# Altium schematic sheet Conventions.SchDoc
size A4; SheetNumber: 1; SheetTotal: 3
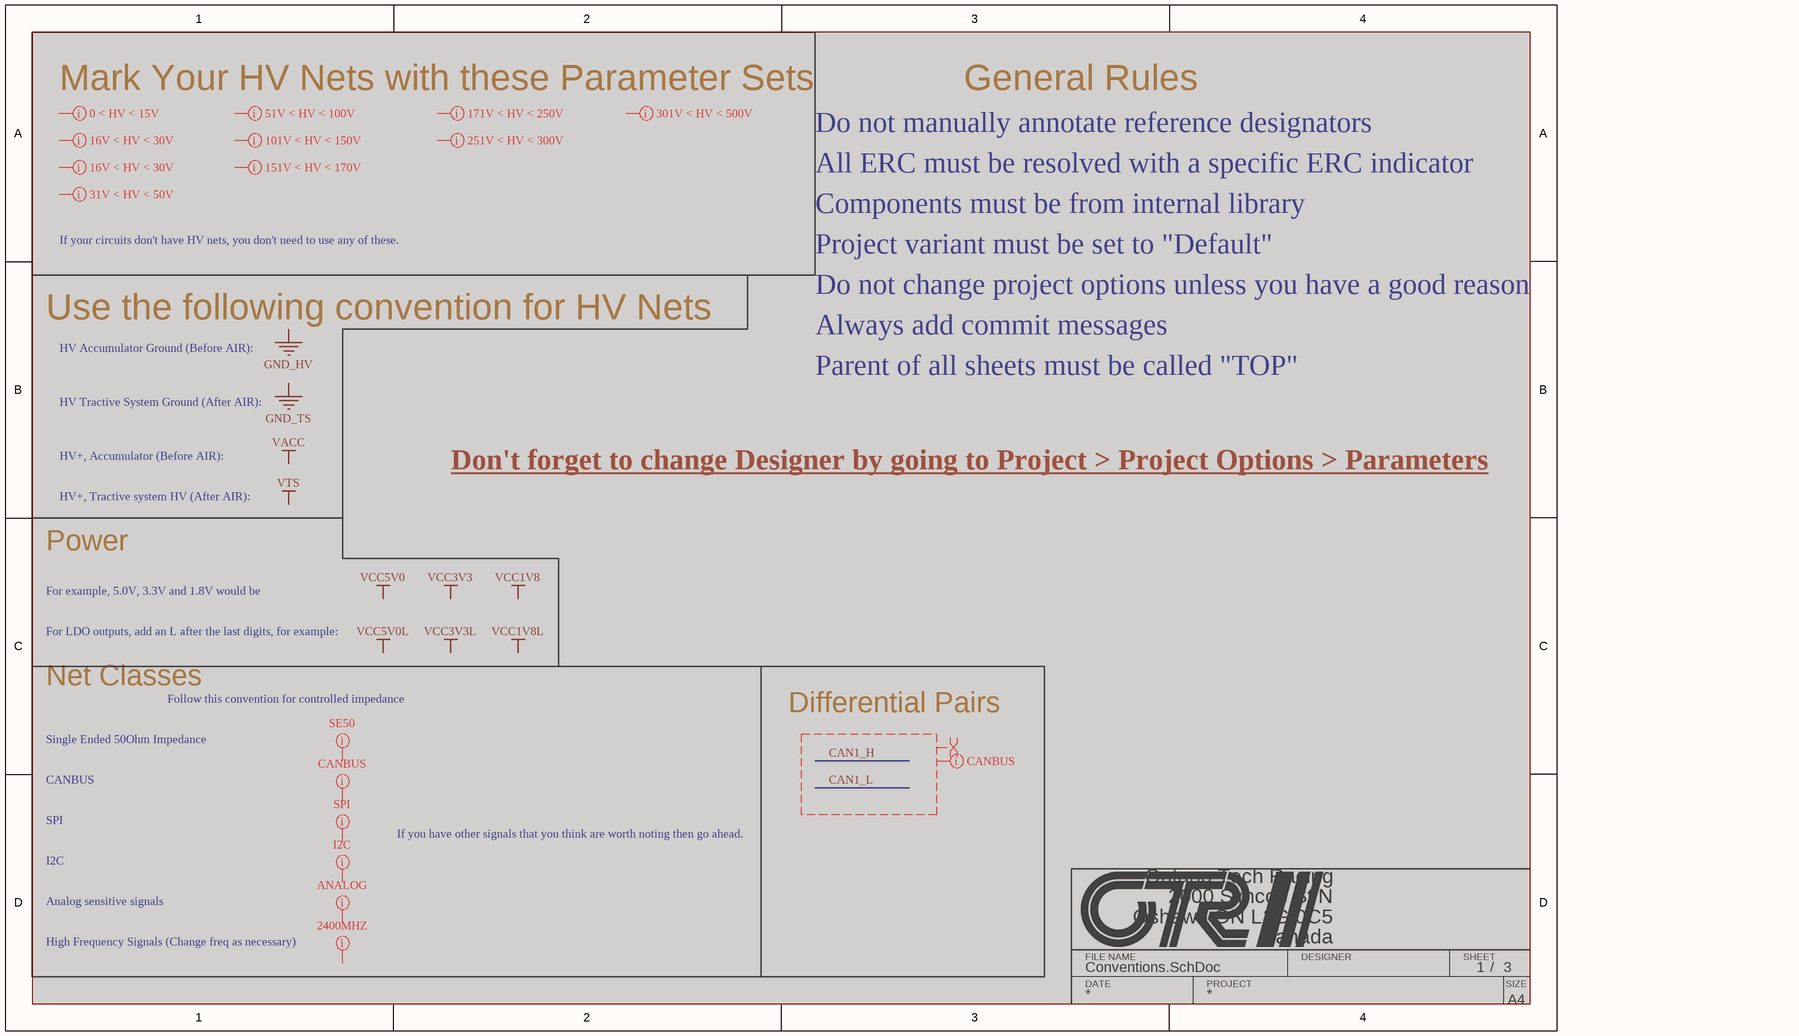
[diagram p0: Conventions.SchDoc]

## Layout directives
net class SE50: (no net found under the mark)
net class HV0_15: (no net found under the mark)
net class HV16_30: (no net found under the mark)
net class CANBUS: (no net found under the mark), CAN1_H, CAN1_L
net class SPI: (no net found under the mark)
net class I2C: (no net found under the mark)
net class ANALOG: (no net found under the mark)
net class 2400: (no net found under the mark)
differential pair: CAN1_H, CAN1_L

## Notes on the sheet
- Mark Your HV Nets with these Parameter Sets
- General Rules
- Do not manually annotate reference designators
- All ERC must be resolved with a specific ERC indicator
- If your circuits don't have HV nets, you don't need to use any of these.
- Components must be from internal library
- Project variant must be set to "Default"
- Do not change project options unless you have a good reason
- Use the following convention for HV Nets
- HV Accumulator Ground (Before AIR):
- Always add commit messages
- Parent of all sheets must be called "TOP"
- HV Tractive System Ground (After AIR):
- HV+, Tractive system HV (After AIR):
- HV+, Accumulator (Before AIR):
- Don't forget to change Designer by going to Project > Project Options > Parameters
- Power
- For example, 5.0V, 3.3V and 1.8V would be
- For LDO outputs, add an L after the last digits, for example:
- Net Classes
- Follow this convention for controlled impedance
- Differential Pairs
- Single Ended 50Ohm Impedance
- CANBUS
- SPI
- If you have other signals that you think are worth noting then go ahead.
- I2C
- Analog sensitive signals
- High Frequency Signals (Change freq as necessary)
- 2000 Simcoe St N
- Oshawa ON L1G 0C5
- Ontario Tech Racing
- FILE NAME
- DATE
- PROJECT
- DESIGNER
- Canada
- SHEET
- /
- A4
- SIZE